# Altium schematic sheet sensor.SchDoc
size A4
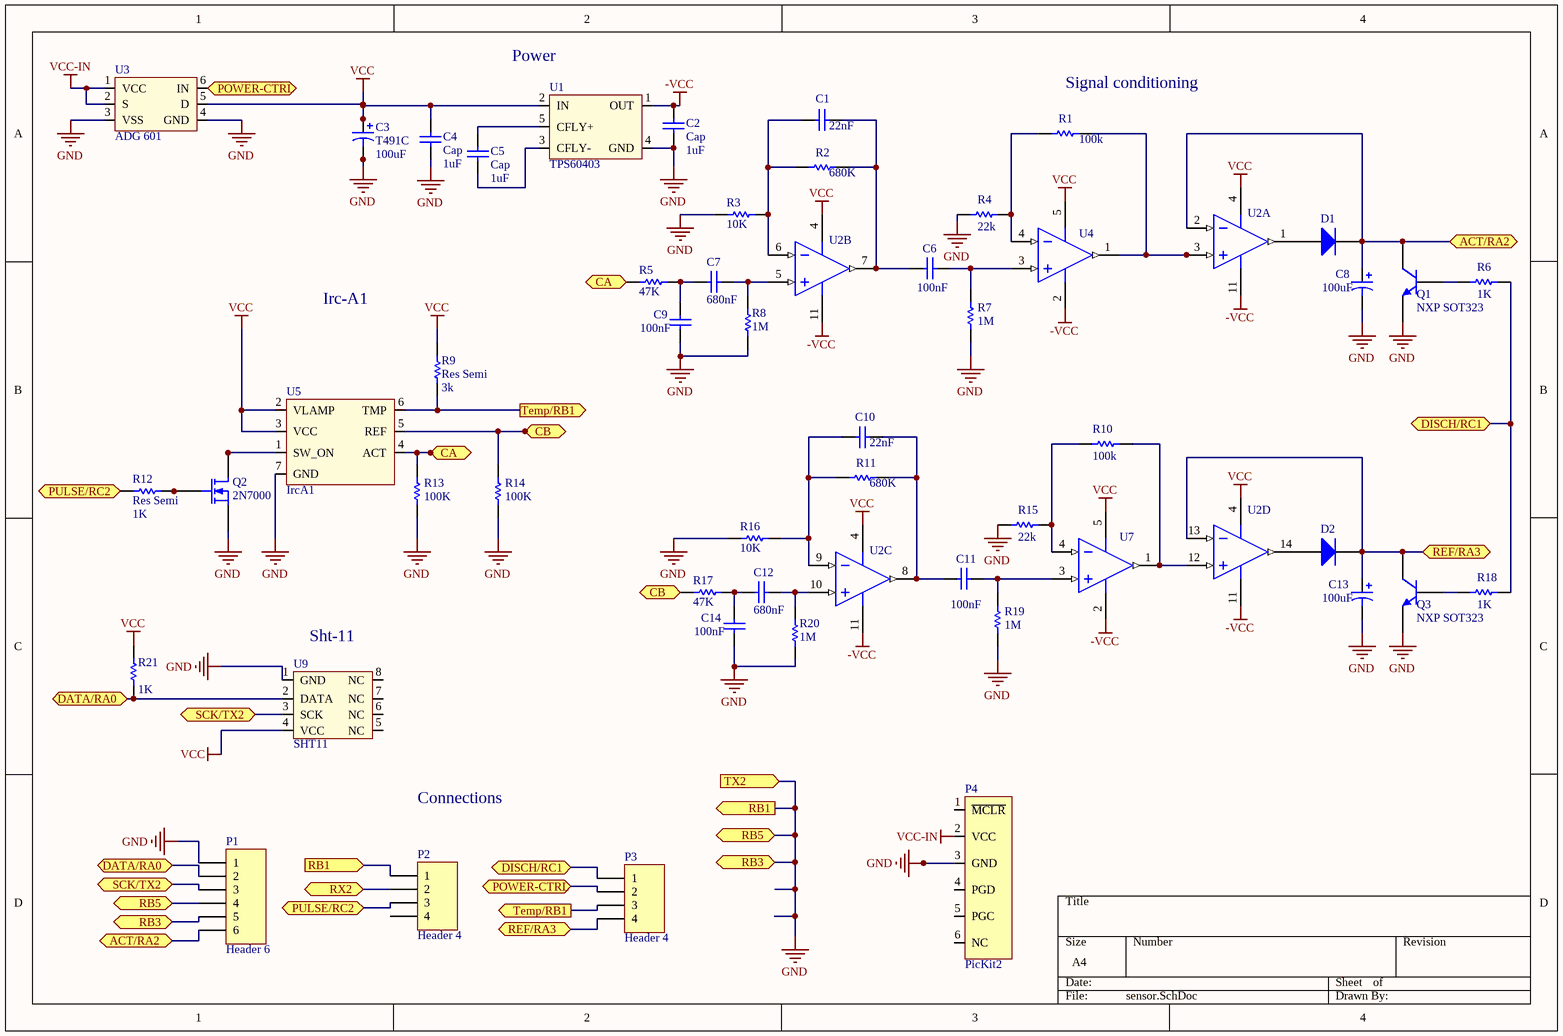
[diagram p0: sensor.SchDoc]

## Parts
C1  value 22nF  [C1206]  (hidden comment: Cap)
C2  Cap  value 1uF  [C1206]
C3  T491C  value 100uF  [C]
C4  Cap  value 1uF  [C1206]
C5  Cap  value 1uF  [C1206]
C6  value 100nF  [C1206]  (hidden comment: Cap)
C7  value 680nF  [C1206]  (hidden comment: Cap)
C8  value 100uF  [C]  (hidden comment: T491C)
C9  value 100nF  [C1206]  (hidden comment: Cap)
C10  value 22nF  [C1206]  (hidden comment: Cap)
C11  value 100nF  [C1206]  (hidden comment: Cap)
C12  value 680nF  [C1206]  (hidden comment: Cap)
C13  value 100uF  [C]  (hidden comment: T491C)
C14  value 100nF  [C1206]  (hidden comment: Cap)
D1  Diode 1N4148  [LED SMD 1206]  (value not drawn)
D2  Diode 1N4148  [LED SMD 1206]  (value not drawn)
P1  Header 6  [HDR1X6]
P2  Header 4  [HDR1X4]
P3  Header 4  [HDR1X4]
P4  PicKit2  [PICKIT3]
Q1  NXP SOT323  [SOT323-3BM]
Q2  2N7000  [SOT23-3L]
Q3  NXP SOT323  [SOT323-3BM]
R1  value 100k  [3216[1206]]  (hidden comment: Res Semi)
R2  value 680K  [3216[1206]]  (hidden comment: Res Semi)
R3  value 10K  [3216[1206]]  (hidden comment: Res Semi)
R4  value 22k  [3216[1206]]  (hidden comment: Res Semi)
R5  value 47K  [3216[1206]]  (hidden comment: Res Semi)
R6  value 1K  [3216[1206]]  (hidden comment: Res Semi)
R7  value 1M  [3216[1206]]  (hidden comment: Res Semi)
R8  value 1M  [3216[1206]]  (hidden comment: Res Semi)
R9  Res Semi  value 3k  [3216[1206]]
R10  value 100k  [3216[1206]]  (hidden comment: Res Semi)
R11  value 680K  [3216[1206]]  (hidden comment: Res Semi)
R12  Res Semi  value 1K  [3216[1206]]
R13  value 100K  [3216[1206]]  (hidden comment: Res Semi)
R14  value 100K  [3216[1206]]  (hidden comment: Res Semi)
R15  value 22k  [3216[1206]]  (hidden comment: Res Semi)
R16  value 10K  [3216[1206]]  (hidden comment: Res Semi)
R17  value 47K  [3216[1206]]  (hidden comment: Res Semi)
R18  value 1K  [3216[1206]]  (hidden comment: Res Semi)
R19  value 1M  [3216[1206]]  (hidden comment: Res Semi)
R20  value 1M  [3216[1206]]  (hidden comment: Res Semi)
R21  value 1K  [3216[1206]]  (hidden comment: Res Semi)
U1  TPS60403  [SOT23-5AL]
U2  LM324M  [M14A_M]  (value not drawn)  (parts A,B,C,D of 4)
U3  ADG 601  [SOT26A-6N]
U4  MAX4250EUK-T  [SOT23-5AN]  (value not drawn)
U5  IrcA1  [IrcA1]
U7  MAX4250EUK-T  [SOT23-5AN]  (value not drawn)
U9  SHT11  [SHT11]

## Ports
ACT/RA2 (bidir), CA (in), CA (out), CB (in), CB (out), DATA/RA0 (bidir), DISCH/RC1 (bidir), POWER-CTRL (bidir), PULSE/RC2 (bidir), RB1 (in), RB1 (out), RB3 (bidir), RB5 (bidir), REF/RA3 (bidir), RX2 (out), SCK/TX2 (bidir), Temp/RB1 (out), TX2 (in)

## Nets
-VCC: C2.2 U1.1(OUT) U2.11(GND) U4.2(VSS) U7.2(VSS)
GND: C2.1 C3.2 C4.2 C8.2 C9.1 C13.2 C14.1 P1.1 P1.4 P1.5 P2.1 P4.3(GND) Q1.3(E) Q2.1(S) Q3.3(E) R3.1 R4.2 R7.1 R8.1 R13.2 R14.2 R15.2 R16.1 R19.1 R20.1 U1.4(GND) U3.3(VSS) U3.4(GND) U5.7(GND) U9.1(GND) ; port RB1, port RB3, port RB5, port TX2
VCC: C3.1 C4.1 R9.2 R21.2 U1.2(IN) U2.4(V+) U3.5(D) U4.5(VDD) U5.2(VLAMP) U5.3(VCC) U7.5(VDD) U9.4(VCC)
VCC-IN: P4.2(VCC) U3.1(VCC) U3.2(S)
ACT/RA2: C8.1 D1.2(K) P1.6 Q1.2(C) U2.2(IN1-) ; port ACT/RA2
CA: R5.2 R13.1 U5.4(ACT) ; port CA
CB: R14.1 R17.2 U5.5(REF) ; port CB
DATA/RA0: P1.2 R21.1 U9.2(DATA) ; port DATA/RA0
DISCH/RC1: P3.1 R6.2 R18.2 ; port DISCH/RC1
POWER-CTRL: P3.2 U3.6(IN) ; port POWER-CTRL
PULSE/RC2: P2.3 R12.1 ; port PULSE/RC2
REF/RA3: C13.1 D2.2(K) P3.4 Q3.2(C) U2.13(IN4-) ; port REF/RA3
RX2: P2.2 ; port RX2
SCK/TX2: P1.3 U9.3(SCK) ; port SCK/TX2
Temp/RB1: P3.3 R9.1 U5.6(TMP) ; port Temp/RB1
NetC1_1: C1.1 R2.1 R3.2 U2.6(IN2-)
NetC1_2: C1.2 C6.1 R2.2 U2.7(OUT2)
NetC5_1: C5.1 U1.5(CFLY+)
NetC5_2: C5.2 U1.3(CFLY-)
NetC6_2: C6.2 R7.2 U4.3(IN+)
NetC7_1: C7.1 C9.2 R5.1
NetC7_2: C7.2 R8.2 U2.5(IN2+)
NetC10_1: C10.1 R11.1 R16.2 U2.9(IN3-)
NetC10_2: C10.2 C11.1 R11.2 U2.8(OUT3)
NetC11_2: C11.2 R19.2 U7.3(IN+)
NetC12_1: C12.1 C14.2 R17.1
NetC12_2: C12.2 R20.2 U2.10(IN3+)
NetD1_1: D1.1(A) U2.1(OUT1)
NetD2_1: D2.1(A) U2.14(OUT4)
NetQ1_1: Q1.1(B) R6.1
NetQ2_2: Q2.2(G) R12.2
NetQ2_3: Q2.3(D) U5.1(SW_ON)
NetQ3_1: Q3.1(B) R18.1
NetR1_1: R1.1 U2.3(IN1+) U4.1(OUT)
NetR1_2: R1.2 R4.1 U4.4(IN-)
NetR10_1: R10.1 U2.12(IN4+) U7.1(OUT)
NetR10_2: R10.2 R15.1 U7.4(IN-)

Not connected (* = marked no-connect by the designer): P2 4; P4 1(~{MCLR}) 4(PGD) 5(PGC) 6(NC); U9 5(NC) 6(NC) 7(NC) 8(NC)

## Notes on the sheet
- (near U1) Power
- (near R1) Signal conditioning
- Irc-A1
- (near U9) Sht-11
- Connections

## Library data of the parts
C1 C2 C4-C7 C9-C12 C14 = Cap: Capacitor; Published: 8-Jun-2000; LatestRevisionDate: 17-Jul-2002; LatestRevisionNote: Re-released for DXP Platform.; PackageReference: RAD-0.3; Publisher: Altium Limited; PackageDescription: Radial Cap, Thru-Hole; 2 Leads; 0.3 in Pin Spacing
C3 C8 C13 = T491C: Solid Tantalum Chip Capacitor, Standard T491 Series - Industrial Grade; Published: 17-Jul-2002; LatestRevisionDate: 19-Mar-2004; LatestRevisionNote: Silkscreen dimensions re-sized.; DatasheetDocument: Mar-2001; PackageDocument: Mar-2001; PackageReference: C; Publisher: Altium Limited; Code_JEITA: 6032-28; ComponentLink1Description: Manufacturer Link; ComponentLink1URL: http://www.kemet.com/; ComponentLink2Description: Datasheet; ComponentLink2URL: http://www.kemet.com/kemet/web/homepage/kechome.nsf/vapubfilesname/F3102TA.pdf/$file/F3102TA.pdf
D1 D2 = Diode 1N4148: High Conductance Fast Diode; Published: 8-Jun-2000; LatestRevisionDate: 17-Jul-2002; LatestRevisionNote: Re-released for DXP Platform.; DatasheetDocument: 1997; PackageReference: DO-35; Publisher: Altium Limited; Code_JEDEC: DO-204-AH; ComponentLink1Description: Manufacturer Link; ComponentLink1URL: http://www.fairchildsemi.com/; ComponentLink2Description: Datasheet; ComponentLink2URL: http://www.fairchildsemi.com/ds/1N%2F1N4148.pdf
P1 = Header 6: Header, 6-Pin; LatestRevisionDate: 17-Jul-2002; LatestRevisionNote: Re-released for DXP Platform.; Publisher: Altium Limited
P2 P3 = Header 4: Header, 4-Pin; LatestRevisionDate: 17-Jul-2002; LatestRevisionNote: Re-released for DXP Platform.; Publisher: Altium Limited
Q1 Q3 = 2N2222A: High Speed Switches; pin to pad: 2>3 3>2; Published: 8-Jun-2000; LatestRevisionDate: 11-Dec-2002; LatestRevisionNote: Sim Port Map correction; DatasheetVersion: Jun-1999; PackageReference: TO-18; Publisher: Altium Limited; PackageDescription: Can; 3 Leads; Pin Circle Dia. 2.54 mm; Lead Dia. 0.49 mm (max); ComponentLink1Description: Manufacturer Link; ComponentLink1URL: http://www.st.com/; ComponentLink2Description: Datasheet; ComponentLink2URL: http://www.st.com/stonline/products/literature/ds/9288/2n2219a.pdf
Q2 = 2N7000: N-Channel Enhancement Mode Vertical DMOS FET; pin to pad: 1>2 2>1; Published: 8-Jun-2000; LatestRevisionDate: 17-Jul-2002; LatestRevisionNote: Re-released for DXP Platform.; DatasheetVersion: Nov-1994; PackageVersion: 1995; PackageReference: T092; Publisher: Altium Limited; PackageDescription: TO, Flat Index; 3 In-Line, Axial Leads; Body Dia. 4.7mm; Leads 0.56 x 0.51 mm (max); ComponentLink1Description: Manufacturer Link; ComponentLink1URL: http://www.zetex.com/
R1-R21 = Res Semi: Semiconductor Resistor; Published: 8-Jun-2000; LatestRevisionDate: 17-Jul-2002; LatestRevisionNote: Re-released for DXP Platform.; PackageReference: AXIAL-0.5; Publisher: Altium Limited
U2 = LM324M: Low Power Quad Operational Amplifier; Manufacturer: National Semiconductor; CompType: Amplifiers; PackageTopMarking: NSUZXYTT*LM324M; PowerWise: N; Published: 4-Dec-2008; LatestRevisionDate: 13-Jan-2009; LatestRevisionNote: Sim Model Added.; DatasheetVersion: Aug-2000; PackageVersion: revJ, Jan-1996; PackageReference: M14A; Publisher: Altium Limited; PackageDescription: Molded Package S.O., .150in Wide, 14 Lead; PartNumber: LM324M; RoHS: O; PinCount: 14; DigiKeyPartNumber: LM324MXCT-ND; Code_JEDEC: MS-012AB; Code_IPC: SOIC127P600-14; ComponentLink1Description: LM324 Datasheet; ComponentLink1URL: http://www.national.com/ds/LM/LM324.pdf; ComponentLink2Description: LM324 Web Page; ComponentLink2URL: http://www.national.com/pf/LM/LM324.html; ComponentLink3Description: M14A Package Page; ComponentLink3URL: http://www.national.com/packaging/folders/m14a.html
U4 U7 = MAX4250EUK-T: SOT23, Single-Supply, Low-Noise, Low-Distortion, Rail-to-Rail Op Amp; Published: 23-Sep-2002; LatestRevisionDate: 29-May-2009; LatestRevisionNote: IPC-7351 Footprint Added.; DatasheetVersion: Rev 2; 4/98; PackageVersion: revE, 2004; PackageReference: SOT23-5; Publisher: Altium Limited; PackageDescription: 5-Pin SOT-23 Package 0.95 mm Pitch, 2.8 mm Lead Span; Code_JEITA: SC-74A; Code_IPC: SOT23-5; ComponentLink1Description: Manufacturer Link; ComponentLink1URL: http://www.maxim-ic.com/; ComponentLink2Description: Datasheet; ComponentLink2URL: http://pdfserv.maxim-ic.com/en/ds/MAX4249-MAX4257.pdf